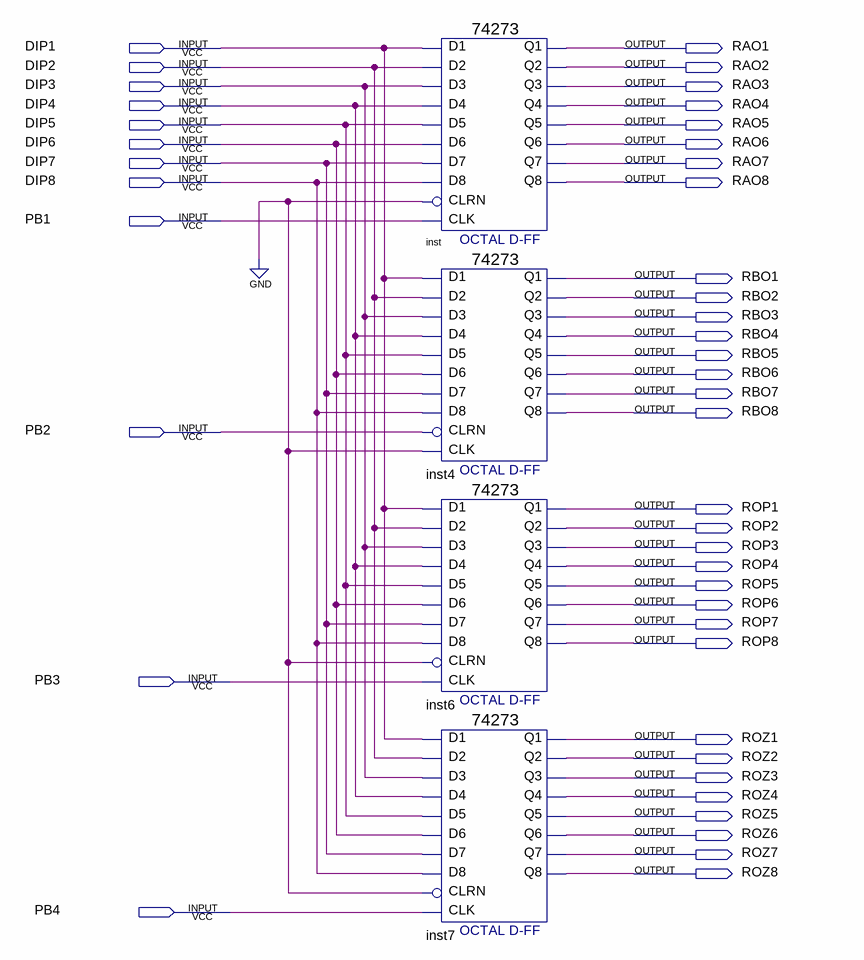
[diagram p0: schematic sheet]
// Quartus schematic Figura3.bdf as structural Verilog: 4 symbols, 44 pins
module Figura3 (
  input  DIP1,
  input  DIP2,
  input  DIP3,
  input  DIP4,
  input  DIP5,
  input  DIP6,
  input  DIP7,
  input  DIP8,
  input  PB1,
  input  PB2,
  input  PB3,
  input  PB4,
  output RAO1,
  output RAO2,
  output RAO3,
  output RAO4,
  output RAO5,
  output RAO6,
  output RAO7,
  output RAO8,
  output RBO1,
  output RBO2,
  output RBO3,
  output RBO4,
  output RBO5,
  output RBO6,
  output RBO7,
  output RBO8,
  output ROP1,
  output ROP2,
  output ROP3,
  output ROP4,
  output ROP5,
  output ROP6,
  output ROP7,
  output ROP8,
  output ROZ1,
  output ROZ2,
  output ROZ3,
  output ROZ4,
  output ROZ5,
  output ROZ6,
  output ROZ7,
  output ROZ8
);

  \74273  inst (
    .D2(DIP2), .D3(DIP3), .D1(DIP1), .D4(DIP4), .D7(DIP7), .D6(DIP6), .D5(DIP5), .D8(DIP8), .CLK(PB1),
    .CLRN(1'b0), .Q4(RAO4), .Q1(RAO1), .Q2(RAO2), .Q3(RAO3), .Q6(RAO6), .Q5(RAO5), .Q7(RAO7), .Q8(RAO8));
  \74273  inst4 (
    .D2(DIP2), .D3(DIP3), .D1(DIP1), .D4(DIP4), .D7(DIP7), .D6(DIP6), .D5(DIP5), .D8(DIP8), .CLK(1'b0),
    .CLRN(PB2), .Q4(RBO4), .Q1(RBO1), .Q2(RBO2), .Q3(RBO3), .Q6(RBO6), .Q5(RBO5), .Q7(RBO7), .Q8(RBO8));
  \74273  inst6 (
    .D2(DIP2), .D3(DIP3), .D1(DIP1), .D4(DIP4), .D7(DIP7), .D6(DIP6), .D5(DIP5), .D8(DIP8), .CLK(PB3),
    .CLRN(1'b0), .Q4(ROP4), .Q1(ROP1), .Q2(ROP2), .Q3(ROP3), .Q6(ROP6), .Q5(ROP5), .Q7(ROP7), .Q8(ROP8));
  \74273  inst7 (
    .D2(DIP2), .D3(DIP3), .D1(DIP1), .D4(DIP4), .D7(DIP7), .D6(DIP6), .D5(DIP5), .D8(DIP8), .CLK(PB4),
    .CLRN(1'b0), .Q4(ROZ4), .Q1(ROZ1), .Q2(ROZ2), .Q3(ROZ3), .Q6(ROZ6), .Q5(ROZ5), .Q7(ROZ7), .Q8(ROZ8));
endmodule
